# EAGLE schematic Busboard v11 (EAGLE 7.3.0)
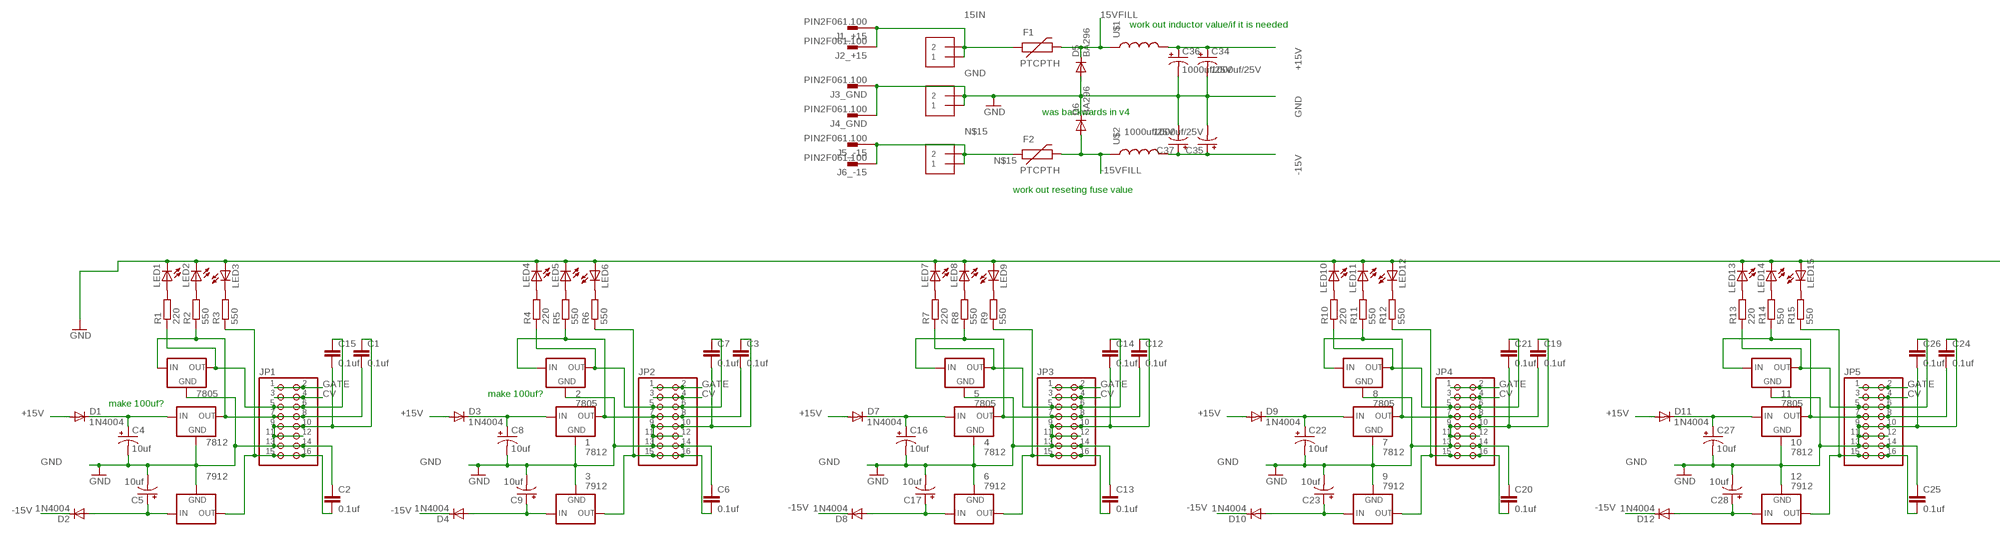
[diagram p0: schematic, sheet 1, part 1 of 2]
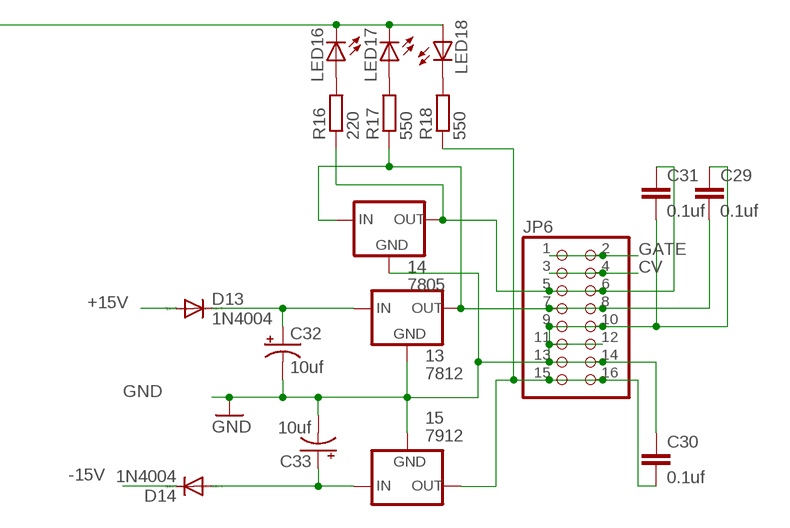
[diagram p1: schematic, sheet 1, part 2 of 2]

## Parts
1  7812  78MXXS  [78MXXS]
2  7805  78MXXS  [78MXXS]
3  7912  79XXS  [79XXS]
4  7812  78MXXS  [78MXXS]
5  7805  78MXXS  [78MXXS]
6  7912  79XXS  [79XXS]
7  7812  78MXXS  [78MXXS]
8  7805  78MXXS  [78MXXS]
9  7912  79XXS  [79XXS]
10  7812  78MXXS  [78MXXS]
11  7805  78MXXS  [78MXXS]
12  7912  79XXS  [79XXS]
13  7812  78MXXS  [78MXXS]
14  7805  78MXXS  [78MXXS]
15  7912  79XXS  [79XXS]
7805  78MXXS  [78MXXS]
7812  78MXXS  [78MXXS]
7912  79XXS  [79XXS]
+15V_DC_IN  1X2-3.5MM  [1X2-3.5MM]
-15V_DC_IN  1X2-3.5MM  [1X2-3.5MM]
C1  0.1uf  0.1UF-50V-20%(PTH)KIT-EZ  [CAP-PTH-SMALL-KIT]
C2  0.1uf  0.1UF-50V-20%(PTH)KIT-EZ  [CAP-PTH-SMALL-KIT]
C3  0.1uf  0.1UF-50V-20%(PTH)KIT-EZ  [CAP-PTH-SMALL-KIT]
C4  10uf  10UF-25V-20%(PTH)  [CPOL-RADIAL-10UF-25V]
C5  10uf  10UF-25V-20%(PTH)  [CPOL-RADIAL-10UF-25V]
C6  0.1uf  0.1UF-50V-20%(PTH)KIT-EZ  [CAP-PTH-SMALL-KIT]
C7  0.1uf  0.1UF-50V-20%(PTH)KIT-EZ  [CAP-PTH-SMALL-KIT]
C8  10uf  10UF-25V-20%(PTH)  [CPOL-RADIAL-10UF-25V]
C9  10uf  10UF-25V-20%(PTH)  [CPOL-RADIAL-10UF-25V]
C12  0.1uf  0.1UF-50V-20%(PTH)KIT-EZ  [CAP-PTH-SMALL-KIT]
C13  0.1uf  0.1UF-50V-20%(PTH)KIT-EZ  [CAP-PTH-SMALL-KIT]
C14  0.1uf  0.1UF-50V-20%(PTH)KIT-EZ  [CAP-PTH-SMALL-KIT]
C15  0.1uf  0.1UF-50V-20%(PTH)KIT-EZ  [CAP-PTH-SMALL-KIT]
C16  10uf  10UF-25V-20%(PTH)  [CPOL-RADIAL-10UF-25V]
C17  10uf  10UF-25V-20%(PTH)  [CPOL-RADIAL-10UF-25V]
C19  0.1uf  0.1UF-50V-20%(PTH)KIT-EZ  [CAP-PTH-SMALL-KIT]
C20  0.1uf  0.1UF-50V-20%(PTH)KIT-EZ  [CAP-PTH-SMALL-KIT]
C21  0.1uf  0.1UF-50V-20%(PTH)KIT-EZ  [CAP-PTH-SMALL-KIT]
C22  10uf  10UF-25V-20%(PTH)  [CPOL-RADIAL-10UF-25V]
C23  10uf  10UF-25V-20%(PTH)  [CPOL-RADIAL-10UF-25V]
C24  0.1uf  0.1UF-50V-20%(PTH)KIT-EZ  [CAP-PTH-SMALL-KIT]
C25  0.1uf  0.1UF-50V-20%(PTH)KIT-EZ  [CAP-PTH-SMALL-KIT]
C26  0.1uf  0.1UF-50V-20%(PTH)KIT-EZ  [CAP-PTH-SMALL-KIT]
C27  10uf  10UF-25V-20%(PTH)  [CPOL-RADIAL-10UF-25V]
C28  10uf  10UF-25V-20%(PTH)  [CPOL-RADIAL-10UF-25V]
C29  0.1uf  0.1UF-50V-20%(PTH)KIT-EZ  [CAP-PTH-SMALL-KIT]
C30  0.1uf  0.1UF-50V-20%(PTH)KIT-EZ  [CAP-PTH-SMALL-KIT]
C31  0.1uf  0.1UF-50V-20%(PTH)KIT-EZ  [CAP-PTH-SMALL-KIT]
C32  10uf  10UF-25V-20%(PTH)  [CPOL-RADIAL-10UF-25V]
C33  10uf  10UF-25V-20%(PTH)  [CPOL-RADIAL-10UF-25V]
C34  1000uf/25V  1000UF-25V(PTH)KIT  [CPOL-RADIAL-1000UF-25V-KIT]
C35  1000uf/25V  1000UF-25V(PTH)KIT  [CPOL-RADIAL-1000UF-25V-KIT]
C36  1000uf/25V  1000UF-25V(PTH)KIT  [CPOL-RADIAL-1000UF-25V-KIT]
C37  1000uf/25V  1000UF-25V(PTH)KIT  [CPOL-RADIAL-1000UF-25V-KIT]
D1  1N4004  [DO41-10]
D2  1N4004  [DO41-10]
D3  1N4004  [DO41-10]
D4  1N4004  [DO41-10]
D5  BA296  [P2-15]
D6  BA296  [P2-15]
D7  1N4004  [DO41-10]
D8  1N4004  [DO41-10]
D9  1N4004  [DO41-10]
D10  1N4004  [DO41-10]
D11  1N4004  [DO41-10]
D12  1N4004  [DO41-10]
D13  1N4004  [DO41-10]
D14  1N4004  [DO41-10]
F1  PTCPTH  [PTC]
F2  PTCPTH  [PTC]
GND_IN  1X2-3.5MM  [1X2-3.5MM]
J1_+15  PIN2F061.100  [F061.100]
J2_+15  PIN2F061.100  [F061.100]
J3_GND  PIN2F061.100  [F061.100]
J4_GND  PIN2F061.100  [F061.100]
J5_-15  PIN2F061.100  [F061.100]
J6_-15  PIN2F061.100  [F061.100]
JP1  PINHD-2X8  [2X08]
JP2  PINHD-2X8  [2X08]
JP3  PINHD-2X8  [2X08]
JP4  PINHD-2X8  [2X08]
JP5  PINHD-2X8  [2X08]
JP6  PINHD-2X8  [2X08]
LED1  LED3MM  [LED3MM]
LED2  LED3MM  [LED3MM]
LED3  LED3MM  [LED3MM]
LED4  LED3MM  [LED3MM]
LED5  LED3MM  [LED3MM]
LED6  LED3MM  [LED3MM]
LED7  LED3MM  [LED3MM]
LED8  LED3MM  [LED3MM]
LED9  LED3MM  [LED3MM]
LED10  LED3MM  [LED3MM]
LED11  LED3MM  [LED3MM]
LED12  LED3MM  [LED3MM]
LED13  LED3MM  [LED3MM]
LED14  LED3MM  [LED3MM]
LED15  LED3MM  [LED3MM]
LED16  LED3MM  [LED3MM]
LED17  LED3MM  [LED3MM]
LED18  LED3MM  [LED3MM]
R1  220  R-EU_0207/5V  [0207/5V]
R2  550  R-EU_0207/5V  [0207/5V]
R3  550  R-EU_0207/5V  [0207/5V]
R4  220  R-EU_0207/5V  [0207/5V]
R5  550  R-EU_0207/5V  [0207/5V]
R6  550  R-EU_0207/5V  [0207/5V]
R7  220  R-EU_0207/5V  [0207/5V]
R8  550  R-EU_0207/5V  [0207/5V]
R9  550  R-EU_0207/5V  [0207/5V]
R10  220  R-EU_0207/5V  [0207/5V]
R11  550  R-EU_0207/5V  [0207/5V]
R12  550  R-EU_0207/5V  [0207/5V]
R13  220  R-EU_0207/5V  [0207/5V]
R14  550  R-EU_0207/5V  [0207/5V]
R15  550  R-EU_0207/5V  [0207/5V]
R16  220  R-EU_0207/5V  [0207/5V]
R17  550  R-EU_0207/5V  [0207/5V]
R18  550  R-EU_0207/5V  [0207/5V]
U$1  INDUCTORRLB0912  [RLB0912]
U$2  INDUCTORRLB0912  [RLB0912]

## Nets
15IN: +15V_DC_IN.1 +15V_DC_IN.2 F1.P$1 J1_+15.A1 J1_+15.A2 J2_+15.A1 J2_+15.A2
15VFILL: D5.C F1.P$2 U$1.1
+15V: C34.+ C36.+ D1.A D3.A D7.A D9.A D11.A D13.A U$1.2
-15V: C35.+ C37.+ D2.C D4.C D8.C D10.C D12.C D14.C U$2.2
-15VFILL: D6.A F2.P$2 U$2.1
CV: JP1.3 JP1.4 JP2.3 JP2.4 JP3.3 JP3.4 JP4.3 JP4.4 JP5.3 JP5.4 JP6.3 JP6.4
GATE: JP1.1 JP1.2 JP2.1 JP2.2 JP3.1 JP3.2 JP4.1 JP4.2 JP5.1 JP5.2 JP6.1 JP6.2
GND: 1.GND 2.GND 3.GND 4.GND 5.GND 6.GND 7.GND 8.GND 9.GND 10.GND 11.GND 12.GND 13.GND 14.GND 15.GND 7805.GND 7812.GND 7912.GND C1.1 C2.1 C3.1 C4.2(-) C5.2(-) C6.1 C7.2 C8.2(-) C9.2(-) C12.1 C13.1 C14.2 C15.2 C16.2(-) C17.2(-) C19.1 C20.1 C21.2 C22.2(-) C23.2(-) C24.1 C25.1 C26.2 C27.2(-) C28.2(-) C29.1 C30.1 C31.2 C32.2(-) C33.2(-) C34.- C35.- C36.- C37.- D5.A D6.C GND_IN.1 GND_IN.2 J3_GND.A1 J3_GND.A2 J4_GND.A1 J4_GND.A2 JP1.9 JP1.10 JP1.11 JP1.12 JP1.13 JP1.14 JP2.9 JP2.10 JP2.11 JP2.12 JP2.13 JP2.14 JP3.9 JP3.10 JP3.11 JP3.12 JP3.13 JP3.14 JP4.9 JP4.10 JP4.11 JP4.12 JP4.13 JP4.14 JP5.9 JP5.10 JP5.11 JP5.12 JP5.13 JP5.14 JP6.9 JP6.10 JP6.11 JP6.12 JP6.13 JP6.14 LED1.K(C) LED2.K(C) LED3.A LED4.K(C) LED5.K(C) LED6.A LED7.K(C) LED8.K(C) LED9.A LED10.K(C) LED11.K(C) LED12.A LED13.K(C) LED14.K(C) LED15.A LED16.K(C) LED17.K(C) LED18.A
N$1: 7912.IN C5.1(+) D2.A
N$2: 7912.OUT C2.2 JP1.15 JP1.16 R3.1
N$3: 6.OUT C13.2 JP3.15 JP3.16 R9.1
N$4: 7812.IN C4.1(+) D1.C
N$5: 7805.IN 7812.OUT C1.2 JP1.7 JP1.8 R2.1
N$6: 3.OUT C6.2 JP2.15 JP2.16 R6.1
N$7: 6.IN C17.1(+) D8.A
N$8: 3.IN C9.1(+) D4.A
N$9: 1.IN C8.1(+) D3.C
N$12: LED1.A R1.2
N$14: LED2.A R2.2
N$15: -15V_DC_IN.1 -15V_DC_IN.2 F2.P$1 J5_-15.A1 J5_-15.A2 J6_-15.A1 J6_-15.A2
N$17: LED3.K(C) R3.2
N$18: 1.OUT 2.IN C3.2 JP2.7 JP2.8 R5.1
N$19: 4.IN C16.1(+) D7.C
N$20: 2.OUT C7.1 JP2.5 JP2.6 R4.1
N$21: 7805.OUT C15.1 JP1.5 JP1.6 R1.1
N$23: LED4.A R4.2
N$24: LED5.A R5.2
N$25: LED6.K(C) R6.2
N$26: 4.OUT 5.IN C12.2 JP3.7 JP3.8 R8.1
N$27: 5.OUT C14.1 JP3.5 JP3.6 R7.1
N$28: LED7.A R7.2
N$29: LED8.A R8.2
N$30: LED9.K(C) R9.2
N$47: 9.OUT C20.2 JP4.15 JP4.16 R12.1
N$48: 9.IN C23.1(+) D10.A
N$49: 7.IN C22.1(+) D9.C
N$50: 7.OUT 8.IN C19.2 JP4.7 JP4.8 R11.1
N$51: 8.OUT C21.1 JP4.5 JP4.6 R10.1
N$52: LED10.A R10.2
N$53: LED11.A R11.2
N$54: LED12.K(C) R12.2
N$55: 15.OUT C30.2 JP6.15 JP6.16 R18.1
N$56: 12.OUT C25.2 JP5.15 JP5.16 R15.1
N$57: 12.IN C28.1(+) D12.A
N$58: 10.IN C27.1(+) D11.C
N$59: 10.OUT 11.IN C24.2 JP5.7 JP5.8 R14.1
N$60: 11.OUT C26.1 JP5.5 JP5.6 R13.1
N$61: LED13.A R13.2
N$62: LED14.A R14.2
N$63: LED15.K(C) R15.2
N$64: 15.IN C33.1(+) D14.A
N$65: 13.IN C32.1(+) D13.C
N$66: 13.OUT 14.IN C29.2 JP6.7 JP6.8 R17.1
N$67: 14.OUT C31.1 JP6.5 JP6.6 R16.1
N$68: LED16.A R16.2
N$69: LED17.A R17.2
N$70: LED18.K(C) R18.2

## Notes on the sheet
- work out inductor value/if it is needed
- was backwards in v4
- work out reseting fuse value
- make 100uf?
- make 100uf?

## Library data of the parts
1 2 4 5 7 8 10 11 13 14 7805 7812 = v-reg:78MXXS: VOLTAGE REGULATOR
3 6 9 12 15 7912 = v-reg:79XXS: VOLTAGE REGULATOR
+15V_DC_IN -15V_DC_IN GND_IN = adafruit:1X2: 3.5mm Terminal block http://www.ladyada.net/library/pcb/eaglelibrary.html
C1-C3 C6 C7 C12-C15 C19-C21 C24-C26 C29-C31 = SparkFun-Capacitors:0.1UF-50V-20%(PTH): CAP-08370; PROD_ID: CAP-08370
C4 C5 C8 C9 C16 C17 C22 C23 C27 C28 C32 C33 = SparkFun-Capacitors:10UF-25V-20%(PTH): CAP-08440; PROD_ID: CAP-08440
C34-C37 = SparkFun-Capacitors:1000UF-25V(PTH): CAP-08070; PROD_ID: CAP-09538
D1-D4 D7-D14 = diode:1N4004: DIODE general purpose rectifier, 1 A
D5 D6 = diode:BA296: DIODE
F1 F2 = SparkFun-PowerIC:PTC: Resettable Fuse PTC Resettable Fuse. Spark Fun Electronics SKU : COM-08357
J1_+15 J2_+15 J3_GND J4_GND J5_-15 J6_-15 = con-faston:PIN2: Flachstecker Typ Tyco/Electronics/AMP TAB, FASTON Printed Circuit Board Tabs Source: http://www.buerklin.com, http://catalog.tycoelectronics.com; OC_FARNELL: unknown; OC_NEWARK: unknown
JP1-JP6 = pinhead:PINHD-2X8: PIN HEADER
LED1-LED18 = led:LED: LED OSRAM: - CHIPLED LG R971, LG N971, LY N971, LG Q971, LY Q971, LO R971, LY R971 LH N974, LH R974 LS Q976, LO Q976, LY Q976 LO Q996 - Hyper CHIPLED LW Q18S LB Q993, LB Q99A, LB R99A - SideLED LS A670, LO A670, LY A670, LG A670, LP A670 LB A673, LV A673, LT A673, LW A673 LH A674 LY A675 LS A676, LA A676, LO A676, LY A676, LW A676 LS A679, LY A679, LG A679 - Hyper Micro SIDELED® LS Y876, LA Y876, LO Y876, LY Y876 LT Y87S - SmartLED LW L88C, LW L88S LB L89C, LB L89S, LG L890 LS L89K, LO L89K, LY L89K LS L896, LA L896, LO L896, LY L896 - TOPLED LS T670, LO T670, LY T670, LG T670, LP T670 LSG T670, LSP T670, LSY T670, LOP T670, LYG T670 LG T671, LOG T671, LSG T671 LB T673, LV T673, LT T673, LW T673 LH T674 LS T676, LA T676, LO T676, LY T676, LB T676, LH T676, LSB T676, LW T676 LB T67C, LV T67C, LT T67C, LS T67K, LO T67K, LY T67K, LW E67C LS E67B, LA E67B, LO E67B, LY E67B, LB E67C, LV E67C, LT E67C LW T67C LS T679, LY T679, LG T679 LS T770, LO T770, LY T770, LG T770, LP T770 LB T773, LV T773, LT T773, LW T773 LH T774 LS E675, LA E675, LY E675, LS T675 LS T776, LA T776, LO T776, LY T776, LB T776 LHGB T686 LT T68C, LB T68C - Hyper Mini TOPLED® LB M676 - Mini TOPLED Santana® LG M470 LS M47K, LO M47K, LY M47K Source: http://www.osram.convergy.de LUXEON: - LUMILED® LXK2-PW12-R00, LXK2-PW12-S00, LXK2-PW14-U00, LXK2-PW14-V00 LXK2-PM12-R00, LXK2-PM12-S00, LXK2-PM14-U00 LXK2-PE12-Q00, LXK2-PE12-R00, LXK2-PE12-S00, LXK2-PE14-T00, LXK2-PE14-U00 LXK2-PB12-K00, LXK2-PB12-L00, LXK2-PB12-M00, LXK2-PB14-N00, LXK2-PB14-P00, LXK2-PB14-Q00 LXK2-PR12-L00, LXK2-PR12-M00, LXK2-PR14-Q00, LXK2-PR14-R00 LXK2-PD12-Q00, LXK2-PD12-R00, LXK2-PD12-S00 LXK2-PH12-R00, LXK2-PH12-S00 LXK2-PL12-P00, LXK2-PL12-Q00, LXK2-PL12-R00 Source: www.luxeon.com KINGBRIGHT: KA-3528ASYC Source: www.kingbright.com
R1-R18 = resistor:R-EU_: RESISTOR, European symbol
U$1 U$2 = SparkFun-Passives:INDUCTOR: Inductors Basic Inductor/Choke - 0603 and 1206. Footprints are not proven and vary greatly between part numbers. SRN6045- 33uH, 20% 1.4A SDR0403-560KL - 56uH, 10%, 500mA RMS/740mA peak